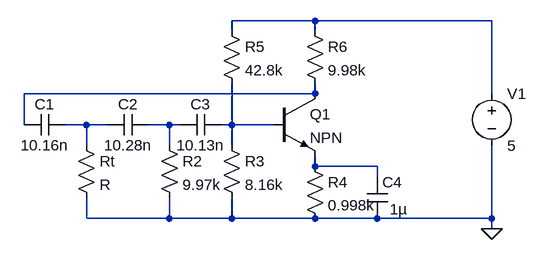
[diagram p0: schematic Oscillator - Print.asc]
Oscillator - Print.asc, the LTspice schematic file:
Version 4
SHEET 1 880 680
WIRE 496 160 368 160
WIRE 768 160 496 160
WIRE 368 176 368 160
WIRE 496 176 496 160
WIRE 496 272 496 256
WIRE 496 272 48 272
WIRE 768 272 768 160
WIRE 48 320 48 272
WIRE 144 320 112 320
WIRE 176 320 144 320
WIRE 272 320 240 320
WIRE 288 320 272 320
WIRE 368 320 368 256
WIRE 368 320 352 320
WIRE 432 320 368 320
WIRE 144 352 144 320
WIRE 272 352 272 320
WIRE 368 352 368 320
WIRE 496 384 496 368
WIRE 592 384 496 384
WIRE 592 400 592 384
WIRE 144 464 144 432
WIRE 272 464 272 432
WIRE 272 464 144 464
WIRE 368 464 368 432
WIRE 368 464 272 464
WIRE 496 464 368 464
WIRE 592 464 496 464
WIRE 768 464 768 352
WIRE 768 464 592 464
WIRE 768 480 768 464
FLAG 768 480 0
SYMBOL res 128 336 R0
SYMATTR InstName Rt
SYMBOL res 256 336 R0
SYMATTR InstName R2
SYMATTR Value 9.97k
SYMBOL res 352 336 R0
SYMATTR InstName R3
SYMATTR Value 8.16k
SYMBOL res 480 368 R0
SYMATTR InstName R4
SYMATTR Value 0.998k
SYMBOL res 352 160 R0
SYMATTR InstName R5
SYMATTR Value 42.8k
SYMBOL res 480 160 R0
SYMATTR InstName R6
SYMATTR Value 9.98k
SYMBOL cap 112 304 R90
WINDOW 0 0 32 VBottom 2
WINDOW 3 32 32 VTop 2
SYMATTR InstName C1
SYMATTR Value 10.16n
SYMBOL cap 240 304 R90
WINDOW 0 0 32 VBottom 2
WINDOW 3 32 32 VTop 2
SYMATTR InstName C2
SYMATTR Value 10.28n
SYMBOL cap 352 304 R90
WINDOW 0 0 32 VBottom 2
WINDOW 3 32 32 VTop 2
SYMATTR InstName C3
SYMATTR Value 10.13n
SYMBOL cap 576 400 R0
WINDOW 3 35 50 Left 2
SYMATTR InstName C4
SYMATTR Value 1µ
SYMBOL npn 432 272 R0
SYMATTR InstName Q1
SYMBOL voltage 768 256 R0
SYMATTR InstName V1
SYMATTR Value 5

The netlist it stands for:
* Oscillator - Print.asc
Rt N003 0 R
R2 N004 0 9.97k
R3 N005 0 8.16k
R4 N006 0 0.998k
R5 N001 N005 42.8k
R6 N001 N002 9.98k
C1 N003 N002 10.16n
C2 N004 N003 10.28n
C3 N005 N004 10.13n
C4 N006 0 1µ
Q1 N002 N005 N006 0 NPN
V1 N001 0 5
.model NPN NPN
.model PNP PNP
.lib standard.bjt
.backanno
.end